# EAGLE design FTWearable (EAGLE 9.6.2)
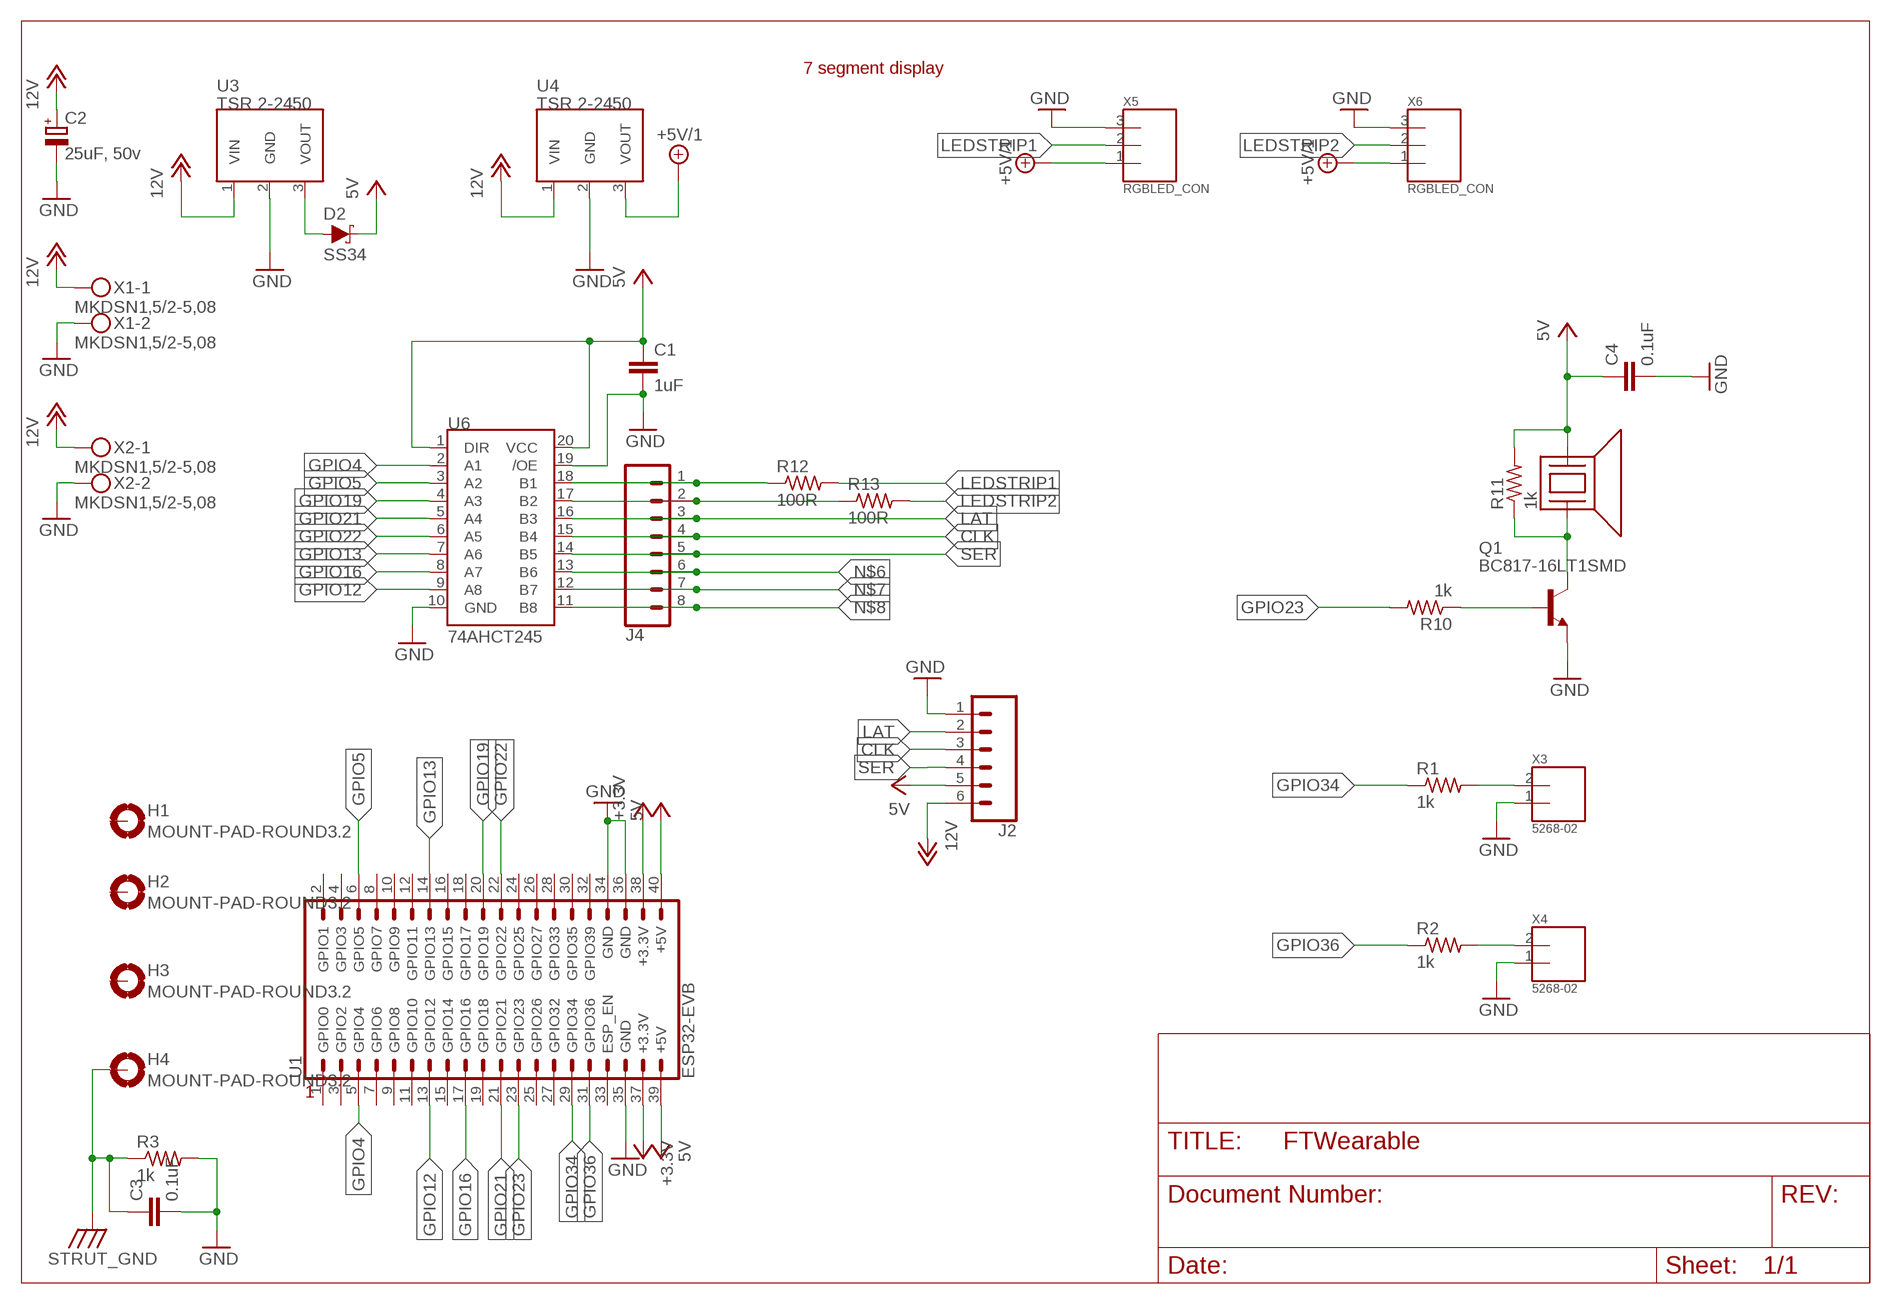
[diagram p0: schematic, sheet 1]

## Parts
C1  1uF  C0805(2012)_LEVEL_A  [C0805(2012)_LEVEL_A]
C2  25uF, 50v  C-POL-PB  [PANASONIC_B_LEVEL_A]
C3  0.1uF  C0603(1608)_LEVEL_A  [C0603(1608)_LEVEL_A]
C4  0.1uF  C0603(1608)_LEVEL_A  [C0603(1608)_LEVEL_A]
D2  SS34  DIODE-SCHOTTKY-LSM115JE3  [DO-214BA]
H1  MOUNT-PAD-ROUND3.2  [3,2-PAD]
H2  MOUNT-PAD-ROUND3.2  [3,2-PAD]
H3  MOUNT-PAD-ROUND3.2  [3,2-PAD]
H4  MOUNT-PAD-ROUND3.2  [3,2-PAD]
J2  CONN_06SILK_FEMALE_PTH  [1X06]
J4  CONN_08"  [1X08]
LED1  SPARKFUN7SEGMENT  [SPARKFUN7SEGMENT]
Q1  BC817-16LT1SMD  [SOT23-BEC]
R1  1k  R0603(1608)_LEVEL_A  [R0603(1608)_LEVEL_A]
R2  1k  R0603(1608)_LEVEL_A  [R0603(1608)_LEVEL_A]
R3  1k  R0603(1608)_LEVEL_A  [R0603(1608)_LEVEL_A]
R10  1k  R0603(1608)_LEVEL_A  [R0603(1608)_LEVEL_A]
R11  1k  R0603(1608)_LEVEL_A  [R0603(1608)_LEVEL_A]
R12  100R  R0603(1608)_LEVEL_A  [R0603(1608)_LEVEL_A]
R13  100R  R0603(1608)_LEVEL_A  [R0603(1608)_LEVEL_A]
U1  ESP32-EVB  [ESP32-EVB]
U3  TSR 2-2450  TSR  [TSR2]
U4  TSR 2-2450  TSR  [TSR2]
U5  BUZZER  [PS1240]
U6  74AHCT245  [TSSOP-20_LEVEL_A]
X1  MKDSN1,5/2-5,08  [MKDSN1,5/2-5,08]
X2  MKDSN1,5/2-5,08  [MKDSN1,5/2-5,08]
X3  5268-02  [5628-02]
X4  5268-02  [5628-02]
X5  RGBLED_CON  [RGBLED_CON]
X6  RGBLED_CON  [RGBLED_CON]

## Nets
5V: C1.1 C4.1 D2.C J2.5 R11.2 U1.39(+5V) U1.40(+5V) U5.1 U6.1(DIR) U6.20(VCC)
12V: C2.1(+) J2.6 U3.1(VIN) U4.1(VIN) X1.1 X2.1
+3.3V: U1.37(+3.3V) U1.38(+3.3V)
+5V/1: U4.3(VOUT) X5.1 X6.1
CLK: J2.3 J4.4 U6.15(B4)
GND: C1.2 C2.2(-) C3.2 C4.2 J2.1 Q1.E R3.2 U1.34(GND) U1.35(GND) U1.36(GND) U3.2(GND) U4.2(GND) U6.10(GND) U6.19(/OE) X1.2 X2.2 X3.1 X4.1 X5.3 X6.3
GPIO4: U1.5(GPIO4) U6.2(A1)
GPIO5: U1.6(GPIO5) U6.3(A2)
GPIO12: U1.13(GPIO12) U6.9(A8)
GPIO13: U1.14(GPIO13) U6.7(A6)
GPIO16: U1.17(GPIO16) U6.8(A7)
GPIO19: U1.20(GPIO19) U6.4(A3)
GPIO21: U1.21(GPIO21) U6.5(A4)
GPIO22: U1.22(GPIO22) U6.6(A5)
GPIO23: R10.2 U1.23(GPIO23)
GPIO34: R1.1 U1.29(GPIO34)
GPIO36: R2.1 U1.31(GPIO36)
LAT: J2.2 J4.3 U6.16(B3)
LEDSTRIP1: R12.2 X5.2
LEDSTRIP2: R13.2 X6.2
N$2: R1.2 X3.2
N$3: R2.2 X4.2
N$6: J4.6 U6.13(B6)
N$7: J4.7 U6.12(B7)
N$8: J4.8 U6.11(B8)
N$10: J4.2 R13.1 U6.17(B2)
N$11: J4.1 R12.1 U6.18(B1)
N$17: Q1.B R10.1
N$18: Q1.C R11.1 U5.2
N$21: D2.A U3.3(VOUT)
SER: J2.4 J4.5 U6.14(B5)
STRUT_GND: C3.1 H4.B3,2(MOUNT) R3.1
Unconnected: H1.B3,2(MOUNT) H2.B3,2(MOUNT) H3.B3,2(MOUNT) U1.1(GPIO0) U1.2(GPIO1) U1.3(GPIO2) U1.4(GPIO3) U1.7(GPIO6) U1.8(GPIO7) U1.9(GPIO8) U1.10(GPIO9) U1.11(GPIO10) U1.12(GPIO11) U1.15(GPIO14) U1.16(GPIO15) U1.18(GPIO17) U1.19(GPIO18) U1.24(GPIO25) U1.25(GPIO26) U1.26(GPIO27) U1.27(GPIO32) U1.28(GPIO33) U1.30(GPIO35) U1.32(GPIO39) U1.33(ESP_EN)

## Library data of the parts
C1 C3 C4 = FTWearable:C
C2 = FETMEurorack:C-POL
D2 = SparkFun-DiscreteSemi:DIODE-SCHOTTKY: Schottky diode A Schottky diode is a semiconductor diode which has a low forward voltage drop and a very fast switching action.; PROD_ID: DIO-15271; VALUE: 1A/15V/220mV
H1-H4 = FTWearable:MOUNT-PAD-ROUND: MOUNTING PAD, round
J2 = SparkFun-Connectors:CONN_06: Multi connection point. Often used as Generic Header-pin footprint for 0.1 inch spaced/style header connections On any of the 0.1 inch spaced packages, you can populate with these: Break Away Headers - Straight <https://www.sparkfun.com/products/116> (PRT-00116) Break Away Male Headers - Right Angle <https://www.sparkfun.com/products/553> (PRT-00553) Female Headers <https://www.sparkfun.com/products/115> (PRT-00115) Break Away Headers - Machine Pin <https://www.sparkfun.com/products/117> (PRT-00117) Break Away Female Headers - Swiss Machine Pin <https://www.sparkfun.com/products/743> (PRT-00743) Arduino Stackable Header - 6 Pin <https://www.sparkfun.com/products/9280> (PRT-09280) For SCREWTERMINALS and SPRING TERMINALS visit here: Screw Terimnals on SparkFun.com <https://www.sparkfun.com/search/results?term=Screw+Terminals> (5mm/3.5mm/2.54mm spacing) This device is also useful as a general connection point to wire up your design to another part of your project. Our various solder wires solder well into these plated through hole pads. Hook-Up Wire - Assortment (Stranded, 22 AWG) <https://www.sparkfun.com/products/11375> (PRT-11375) Hook-Up Wire - Assortment (Solid Core, 22 AWG) <https://www.sparkfun.com/products/11367> (PRT-11367) View the entire wire category on our website here <https://www.sparkfun.com/categories/141>; PROD_ID: CONN-08437
J4 = SparkFun-Connectors:CONN_08: Multi connection point. Often used as Generic Header-pin footprint for 0.1 inch spaced/style header connections On any of the 0.1 inch spaced packages, you can populate with these: Break Away Headers - Straight <https://www.sparkfun.com/products/116> (PRT-00116) Break Away Male Headers - Right Angle <https://www.sparkfun.com/products/553> (PRT-00553) Female Headers <https://www.sparkfun.com/products/115> (PRT-00115) Break Away Headers - Machine Pin <https://www.sparkfun.com/products/117> (PRT-00117) Break Away Female Headers - Swiss Machine Pin <https://www.sparkfun.com/products/743> (PRT-00743) Arduino Stackable Header - 8 Pin <https://www.sparkfun.com/products/9279> (PRT-09279) For SCREWTERMINALS and SPRING TERMINALS visit here: Screw Terimnals on SparkFun.com <https://www.sparkfun.com/search/results?term=Screw+Terminals> (5mm/3.5mm/2.54mm spacing) This device is also useful as a general connection point to wire up your design to another part of your project. Our various solder wires solder well into these plated through hole pads. Hook-Up Wire - Assortment (Stranded, 22 AWG) <https://www.sparkfun.com/products/11375> (PRT-11375) Hook-Up Wire - Assortment (Solid Core, 22 AWG) <https://www.sparkfun.com/products/11367> (PRT-11367) View the entire wire category on our website here <https://www.sparkfun.com/categories/141> Special notes: Molex polarized connector foot print use with SKU : PRT-08231 with associated crimp pins and housings. 1MM SMD Version SKU: PRT-10208 NOTES ON THE VARIANTS LOCK and LOCK_LONGPADS... This footprint was designed to help hold the alignment of a through-hole component (i.e. 6-pin header) while soldering it into place. You may notice that each hole has been shifted either up or down by 0.005 of an inch from it's more standard position (which is a perfectly straight line). This slight alteration caused the pins (the squares in the middle) to touch the edges of the holes. Because they are alternating, it causes a "brace" to hold the component in place. 0.005 has proven to be the perfect amount of "off-center" position when using our standard breakaway headers. Although looks a little odd when you look at the bare footprint, once you have a header in there, the alteration is very hard to notice. Also,if you push a header all the way into place, it is covered up entirely on the bottom side.; PROD_ID: CONN-08438
LED1 = FTWearable:SPARKFUN7SEGMENT
Q1 = GFE:BC817*: NPN Transistor
R1-R3 R10-R13 = FTWearable:R
U1 = FTWearable:ESP32-EVB
U3 U4 = FTWearable:TSR
U5 = GFE:BUZZER
U6 = FTWearable:74AHCT245
X1 X2 = con-phoenix-508:MKDSN1,5/2-5,08: MKDSN 1,5/ 2-5,08 Printklemme Nennstrom: 13,5 A Nennspannung: 250 V Rastermaß: 5,08 mm Polzahl: 2 Anschlussart: Schraubanschluss Montage: Löten Anschlussrichtung Leiter/Platine: 0 ° Artikelnummer: 1729128 Source: http://eshop.phoenixcontact.com .. 1729128.pdf
X3 X4 = GFE:5268-02
X5 X6 = FTWearable:RGBLED_CON

## Board
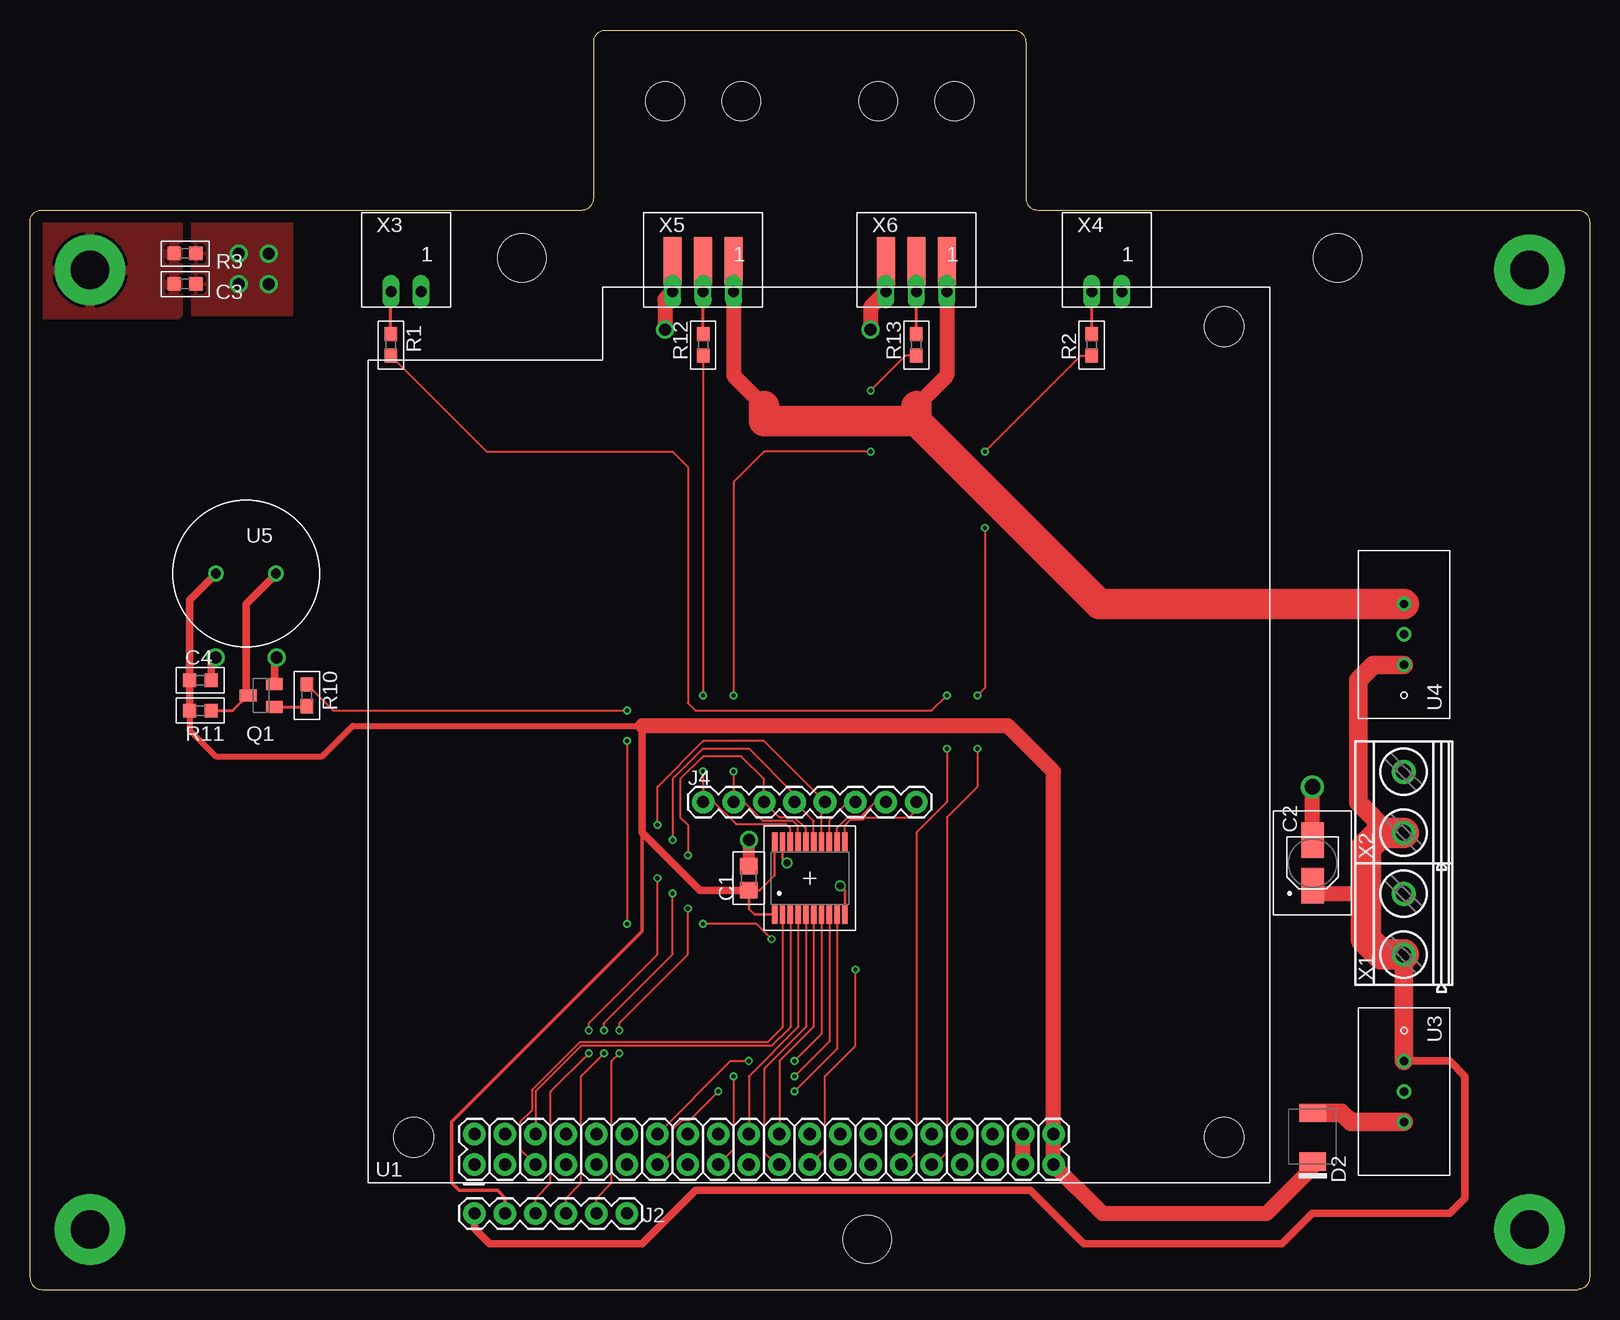
[diagram p1: board, top side]
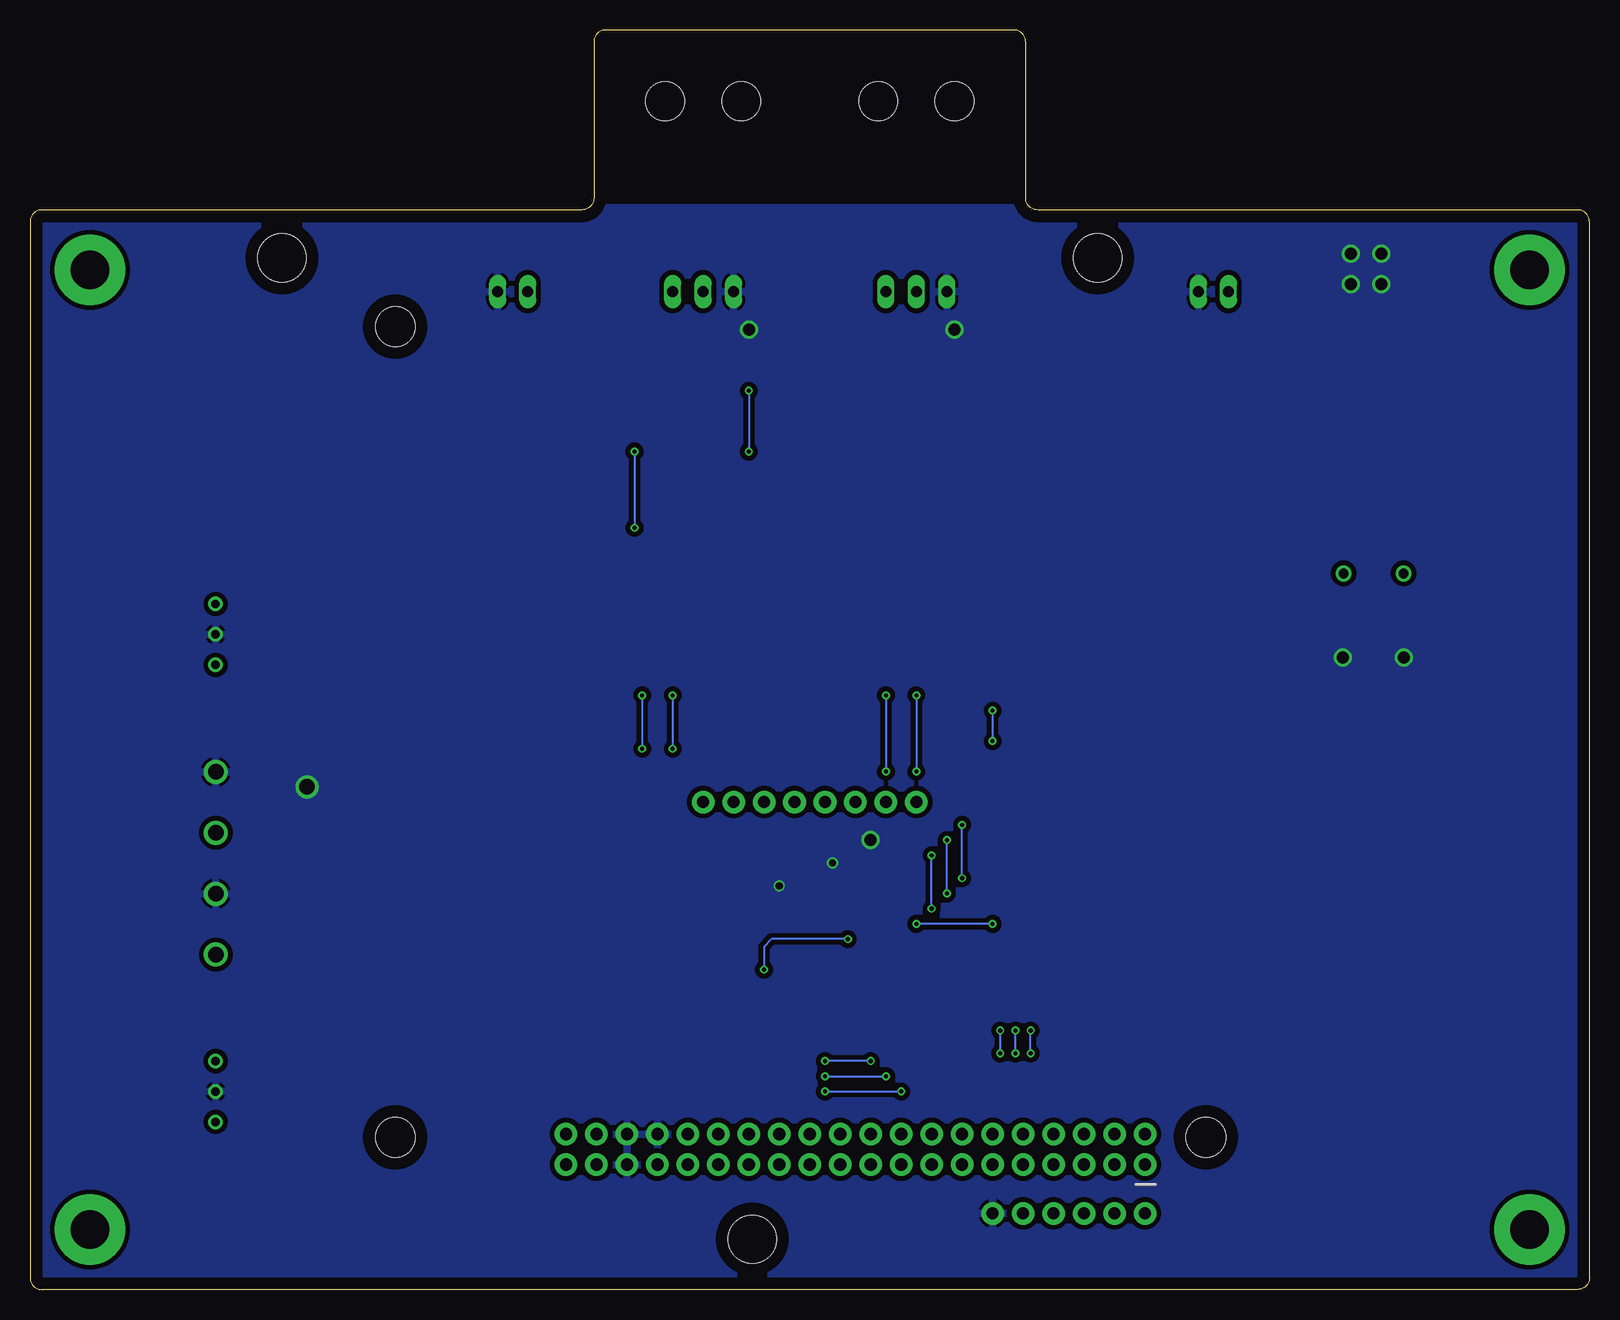
[diagram p2: board, bottom side, seen from below]

Size 130 x 105 mm. Coordinates in mm from the lower left corner, seen from the top.
Outline: 130,89 130,1 arc-90 129,0 1,0 arc-90 0,1 0,89 arc-90 1,90 46,90 arc90 47,91 47,104 arc-90 48,105 82,105 arc-90 83,104 83,91 arc90 84,90 129,90 arc-90 130,89
Copper layers (1*16): Top 0.035mm / dielectric 1.6mm / Bottom 0.035mm
Design rules "default *": minimum track width 6mil, minimum drill 0.35mm, track to track 6mil, track to pad 6mil, pad to pad 6mil, via to via 6mil, smd to smd 6mil, copper to edge 40mil, drill to drill 6mil, minimum pad ring 10mil, minimum via ring 6mil, stop-mask expansion 4mil, vias tented up to drill 0mil, thermal gap 10mil
Holes 3.2 mm at 52.94,99.06 59.28,99.06 70.72,99.06 77.06,99.06

### Footprints (pad centres in the part's own frame; a part is rotated, then mirrored left to right if it is on the bottom)
C0805(2012)_LEVEL_A = smd 1.35 x 1.55: 1 -1,0; 2 1,0
PANASONIC_B_LEVEL_A = smd 2.95 x 1.85: 1 -1.9,0; 2 1.9,0
C0603(1608)_LEVEL_A = smd 1.15 x 1.1: 1 -0.9,0; 2 0.9,0
DO-214BA = smd 1.52 x 2.21: A -2.032,0; C 2.038,0
3,2-PAD = drill 3.2 pad 5.842: B3,2 0,0
1X06 = drill 1.016 pad 1.88: 1 0,0; 2 2.54,0; 3 5.08,0; 4 7.62,0; 5 10.16,0; 6 12.7,0
1X08 = drill 1.016 pad 1.88: 1 0,0; 2 2.54,0; 3 5.08,0; 4 7.62,0; 5 10.16,0; 6 12.7,0; 7 15.24,0; 8 17.78,0
SPARKFUN7SEGMENT = hole 4: 12,131; 80,131; 51.2,49.2
SOT23-BEC = smd 1 x 1.4: B -0.95,-1.1; C 0,1.1; E 0.95,-1.1
R0603(1608)_LEVEL_A = smd 1.15 x 1.1: 1 -0.9,0; 2 0.9,0
ESP32-EVB = drill 1.016 pad 1.88: 1 8.89,1.524; 2 8.89,4.064; 3 11.43,1.524; 4 11.43,4.064; 5 13.97,1.524; 6 13.97,4.064; 7 16.51,1.524; 8 16.51,4.064; 9 19.05,1.524; 10 19.05,4.064; 11 21.59,1.524; 12 21.59,4.064; 13 24.13,1.524; 14 24.13,4.064; 15 26.67,1.524; 16 26.67,4.064; 17 29.21,1.524; 18 29.21,4.064; 19 31.75,1.524; 20 31.75,4.064; 21 34.29,1.524; 22 34.29,4.064; 23 36.83,1.524; 24 36.83,4.064; 25 39.37,1.524; 26 39.37,4.064; 27 41.91,1.524; 28 41.91,4.064; 29 44.45,1.524; 30 44.45,4.064; 31 46.99,1.524; 32 46.99,4.064; 33 49.53,1.524; 34 49.53,4.064; 35 52.07,1.524; 36 52.07,4.064; 37 54.61,1.524; 38 54.61,4.064; 39 57.15,1.524; 40 57.15,4.064 | hole 3.3: 3.81,3.81; 71.374,3.81; 71.374,71.374
TSR2 = drill 0.7 pad 1.2: 1 -2.54,0; 2 0,0; 3 2.54,0
PS1240 = drill 0.8: 1 -2.5,0; 2 2.5,0
TSSOP-20_LEVEL_A = smd 1.65 x 0.45: 1 -3,2.925; 2 -3,2.275; 3 -3,1.625; 4 -3,0.975; 5 -3,0.325; 6 -3,-0.325; 7 -3,-0.975; 8 -3,-1.625; 9 -3,-2.275; 10 -3,-2.925; 11 3,-2.925; 12 3,-2.275; 13 3,-1.625; 14 3,-0.975; 15 3,-0.325; 16 3,0.325; 17 3,0.975; 18 3,1.625; 19 3,2.275; 20 3,2.925
MKDSN1,5/2-5,08 = drill 1.3 pad 2: 1 -2.561,0.025; 2 2.519,0.025
5628-02 = drill 0.9 long: 1 1.25,0; 2 -1.25,0
RGBLED_CON = drill 0.9 long: 1 2.54,0; 2 0,0; 3 -2.54,0 | smd 1.5 x 4: P$1 -2.54,2.54; P$2 0,2.54; P$3 2.54,2.54

### Placement (x,y rotation side)
C1  59.92,34.29 90 top
C2  106.91,35.56 90 top
C3  12.93,83.82 0 top
C4  14.2,50.8 0 top
D2  106.91,12.7 270 top
H1  5,5 0 top
H2  125,5 0 top
H3  125,85 0 top
H4  5,85 0 top
J2  49.76,6.35 180 top
J4  56.11,40.64 0 top
LED1  121,-45 0 bottom
Q1  19.28,49.53 90 top
R1  30.08,78.74 90 top
R2  88.5,78.74 90 top
R3  12.93,86.36 0 top
R10  23.09,49.53 90 top
R11  14.2,48.26 180 top
R12  56.11,78.74 90 top
R13  73.89,78.74 90 top
U1  28.17,8.89 0 top
U3  114.53,16.51 270 top
U4  114.53,54.61 90 top
U5  18.01,59.69 0 top
U6  65,34.29 90 top
X1  114.53,30.48 90 top
X2  114.53,40.64 90 top
X3  31.34,83.19 0 top
X4  89.77,83.19 0 top
X5  56.11,83.19 0 top
X6  73.89,83.19 0 top

### Tracks (layer width: path | path; a pad name or v marks a point on that pad's centre or on a via)
5V
  Top 0.203: U6.20 62.08,34.54 60.83,33.29 C1.1 59.92,31.75 60.38,31.29 U6.1
  Top 0.305: J2.5 39.6,7.62 38.97,8.26 35.79,8.26 35.16,8.89 35.16,13.97 51.03,29.84 51.03,38.1
  Top 0.508: R11.2 13.3,46.62 15.47,44.45 24.36,44.45 26.9,46.99 51.03,46.99
  Top 0.61: R11.2 C4.1 13.3,57.48 U5.1 | C1.1 55.84,33.29 51.03,38.1 51.03,46.99
  Top 1.27: D2.C 106.91,10.16 103.1,6.35 89.38,6.35 U1.39 U1.40 85.32,43.18 81.51,46.99 51.03,46.99
12V
  Top 0.61: J2.6 37.06,5.08 38.33,3.81 51.03,3.81 55.48,8.26 83.41,8.26 87.86,3.81 104.37,3.81 106.91,6.35 118.34,6.35 119.61,7.62 119.61,17.78 118.34,19.05 U3.1
  Top 1.27: X1.1 114.53,27.92 | C2.1 107.55,33.02 111.35,33.02
  Top 1.54: 114.53,27.92 U3.1 | X2.1 113.23,38.08 110.72,40.59 110.72,50.8 111.99,52.07 U4.1
  Top 2.54: X2.1 112.6,38.08 111.35,36.83 111.35,33.02 111.35,29.21 112.65,27.92 114.53,27.92
+3.3V
  Top 1.27: U1.37 U1.38
+5V/1
  Top 1.27: X6.1 76.43,76.2 73.89,73.66 | 61.19,73.66 58.65,76.2 X5.1
  Top 2.54: 73.89,73.66 73.89,72.39 | 73.89,72.39 61.19,72.39 61.19,73.66 | U4.3 89.13,57.15 73.89,72.39
CLK  (via drill 0.35)
  Top 0.152: U6.15 65.33,39.05 J4.4 63.73,41.27 59.92,45.09 56.11,45.09 53.57,42.55 v53.57,37.47 | J2.3 44.68,7.62 45.95,8.89 45.95,17.78 v47.86,19.68 | v47.86,21.59 47.86,22.23 53.57,27.94 v53.57,33.02
  Bottom 0.152: v47.86,19.68 v47.86,21.59 | v53.57,33.02 v53.57,37.47
GND  (via drill 0.6, 1, 1.27)
  Top 0.203: U6.19 62.73,35.93 v63.09,35.56 | U6.10 67.92,33.27 v67.54,33.66
  Top 0.61: Q1.E 20.38,52.7 v20.55,52.7 | C4.2 15.1,52.7 v15.47,52.7
  Top 1.016: C1.2 v59.92,37.47
  Top 1.27: C2.2 v106.91,41.91 | X6.3 70.08,81.92 v70.08,80.01 | X5.3 52.94,82.55 v52.94,80.01
  other vias: 17.38,86.36 17.38,83.82 19.91,86.36 19.91,83.82
  pour Bottom (isolate 0.406): -1.04,90.17 131.04,90.17 131.04,0 -1.04,0
  pour Top (isolate 0.305): 13.56,88.9 21.82,88.9 21.82,81.28 13.56,81.28
GPIO4
  Top 0.152: U6.2 62.73,21.86 61.49,20.62 45.82,20.62 41.84,16.64 41.84,14.94 40.87,13.97 40.87,11.68 U1.5
GPIO5
  Top 0.152: U6.3 63.38,21.87 61.83,20.32 45.95,20.32 42.14,16.51 U1.6
GPIO12  (via drill 0.35)
  Top 0.152: v63.73,16.51 67.28,20.05 U6.9 | v57.38,16.51 54.99,14.12 54.36,14.12 53.57,13.34 53.57,11.43 52.55,10.41 U1.13
  Bottom 0.152: v63.73,16.51 v57.38,16.51
GPIO13  (via drill 0.35)
  Top 0.152: v63.73,19.05 65.97,21.3 U6.7 | U1.14 58.4,19.05 v59.92,19.05
  Bottom 0.152: v59.92,19.05 v63.73,19.05
GPIO16  (via drill 0.35)
  Top 0.152: v63.73,17.78 66.62,20.68 U6.8 | v58.65,17.78 58.65,11.68 U1.17
  Bottom 0.152: v63.73,17.78 v58.65,17.78
GPIO19
  Top 0.152: U6.4 64.03,21.89 59.92,17.78 U1.20
GPIO21
  Top 0.152: U1.21 62.21,10.41 61.19,11.43 61.19,18.41 64.67,21.9 U6.5
GPIO22
  Top 0.152: U6.6 65.33,21.91 62.46,19.05 U1.22
GPIO23  (via drill 0.35)
  Top 0.152: U1.23 66.27,11.68 66.27,17.78 68.81,20.32 v68.81,26.67 | R10.2 25.26,48.26 v49.76,48.26 | v49.76,45.72 v49.76,30.48 | v56.11,30.48 60.55,30.48 v61.83,29.21
  Bottom 0.152: v49.76,48.26 v49.76,45.72 | v49.76,30.48 v56.11,30.48 | v61.83,29.21 68.17,29.21 68.81,28.57 v68.81,26.67
GPIO34  (via drill 0.35)
  Top 0.152: v76.43,45.09 76.43,40.64 73.89,38.1 73.89,11.43 72.87,10.41 U1.29 | v76.43,49.53 75.16,48.26 55.48,48.26 54.84,48.9 54.84,68.58 53.57,69.85 38.06,69.85 R1.1
  Bottom 0.152: v76.43,49.53 v76.43,45.09
GPIO36  (via drill 0.35)
  Top 0.152: v78.97,49.53 79.61,50.16 v79.61,63.5 | v78.97,45.09 78.97,41.91 76.43,39.37 76.43,11.43 75.41,10.41 U1.31 | v79.61,69.85 87.59,77.84 R2.1
  Bottom 0.152: v79.61,69.85 v79.61,63.5 | v78.97,49.53 v78.97,45.09
LAT  (via drill 0.35)
  Top 0.152: U6.16 64.67,38.42 63.73,39.37 62.46,39.37 J4.3 61.19,42.55 59.28,44.45 56.11,44.45 54.2,42.55 54.2,39.37 54.84,38.73 v54.84,36.2 | J2.2 47.22,7.62 48.49,8.89 48.49,19.05 v49.12,19.68 | v49.12,21.59 49.12,22.23 54.84,27.94 v54.84,31.75
  Bottom 0.152: v49.12,19.68 v49.12,21.59 | v54.84,31.75 v54.84,36.2
LEDSTRIP1
  Top 0.254: R12.2 X5.2
LEDSTRIP2
  Top 0.254: R13.2 X6.2
N$2
  Top 0.254: R1.2 30.08,83.17 X3.2
N$3
  Top 0.254: R2.2 88.52,79.66 X4.2
N$6
  Top 0.152: U6.13 66.62,39.09 68.17,40.64 J4.6
N$7
  Top 0.152: U6.12 67.28,38.47 68.28,39.47 69.29,39.47 70.46,40.64 J4.7
N$8
  Top 0.152: U6.11 67.92,38.69 68.4,39.17 69.42,39.17 69.62,39.37 73.25,39.37 73.89,40.01 J4.8
N$10  (via drill 0.35)
  Top 0.152: U6.17 64.03,38.64 63.6,39.06 61.11,39.06 59.54,40.64 J4.2 v58.65,43.18 | R13.1 72.99,77.84 v70.08,74.93 | v70.08,69.85 61.19,69.85 58.65,67.31 v58.65,49.53
  Bottom 0.152: v70.08,74.93 v70.08,69.85 | v58.65,49.53 v58.65,43.18
N$11  (via drill 0.35)
  Top 0.152: U6.18 63.38,38.45 63.07,38.76 58.88,38.76 57,40.64 J4.1 v56.11,43.18 | R12.1 v56.11,49.53
  Bottom 0.152: v56.11,49.53 v56.11,43.18
N$17
  Top 0.254: Q1.B 23.04,48.58 R10.1
N$18
  Top 0.254: Q1.C 16.91,48.26 R11.1
  Top 0.61: U5.2 20.51,59.65 18.01,57.15 18.01,49.7 Q1.C
N$21
  Top 1.54: U3.3 110.09,13.97 109.32,14.73 D2.A
SER  (via drill 0.35)
  Top 0.152: U6.14 65.97,40.34 J4.5 61.19,45.72 56.11,45.72 52.3,41.91 v52.3,38.73 | J2.4 42.14,7.62 43.41,8.89 43.41,16.51 v46.59,19.68 | v46.59,21.59 46.59,22.23 52.3,27.94 v52.3,34.29
  Bottom 0.152: v46.59,19.68 v46.59,21.59 | v52.3,34.29 v52.3,38.73
STRUT_GND
  pour Top (isolate 0.305): 0.23,90.17 12.3,90.17 12.3,81.28 0.23,81.28